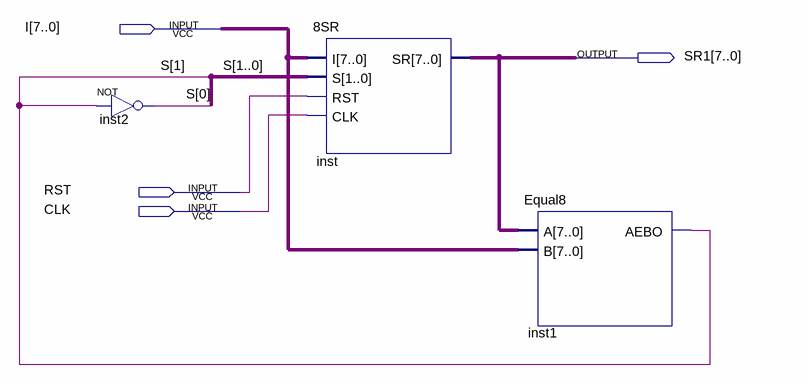
[diagram p0: schematic sheet]
// Quartus schematic 8SR1.bdf as structural Verilog: 3 symbols, 4 pins
module \8SR1  (
  input  [7:0] I,
  input  RST,
  input  CLK,
  output [7:0] SR1
);

  wire [1:0] S;

  not inst2 (S[0], S[1]);
  \8SR  inst (.I(I), .S(S), .RST(RST), .CLK(CLK), .SR(SR1));
  Equal8 inst1 (.A(SR1), .B(I), .AEBO(S[1]));
endmodule
